# Altium schematic sheet TIDA-010954-FullBridge.SchDoc
size 431 x 279 mm; Date: Not shown in title block; ApprovedBy: Not shown in title block; CheckedBy: Not shown in title block; Author: Not shown in title block; CompanyName: Not shown in title block; Engineer: Not shown in title block; Organization: Not shown in title block; Address1: Not shown in title block; Address2: Not shown in title block; Address3: Not shown in title block; Address4: Not shown in title block; DocumentNumber: 2; Revision: Use project parameter SCH_Rev; SheetNumber: 4; SheetTotal: 9; PageSetup: Record=PageOptions|CenterHorizontal=True|CenterVertical=True|PrintScale=1.00|XCorrection=1.00|YCorrection=1.00|PrintKind=0|BorderSize=5000000|LeftOffset=0|BottomOffset=0|Orientation=2|PaperLength=1000|PaperWidth=1000|Scale=100|PaperSource=15|PrintQuality=600|MediaType=1|DitherType=10|PaperKind=Letter|PrintScaleMode=1; CurrentTime: Not shown in title block; CurrentDate: Not shown in title block; Time: Not shown in title block; DocumentFullPathAndName: Not shown in title block; DocumentName: Not shown in title block; ModifiedDate: 1/25/2022; ImagePath: Not shown in title block
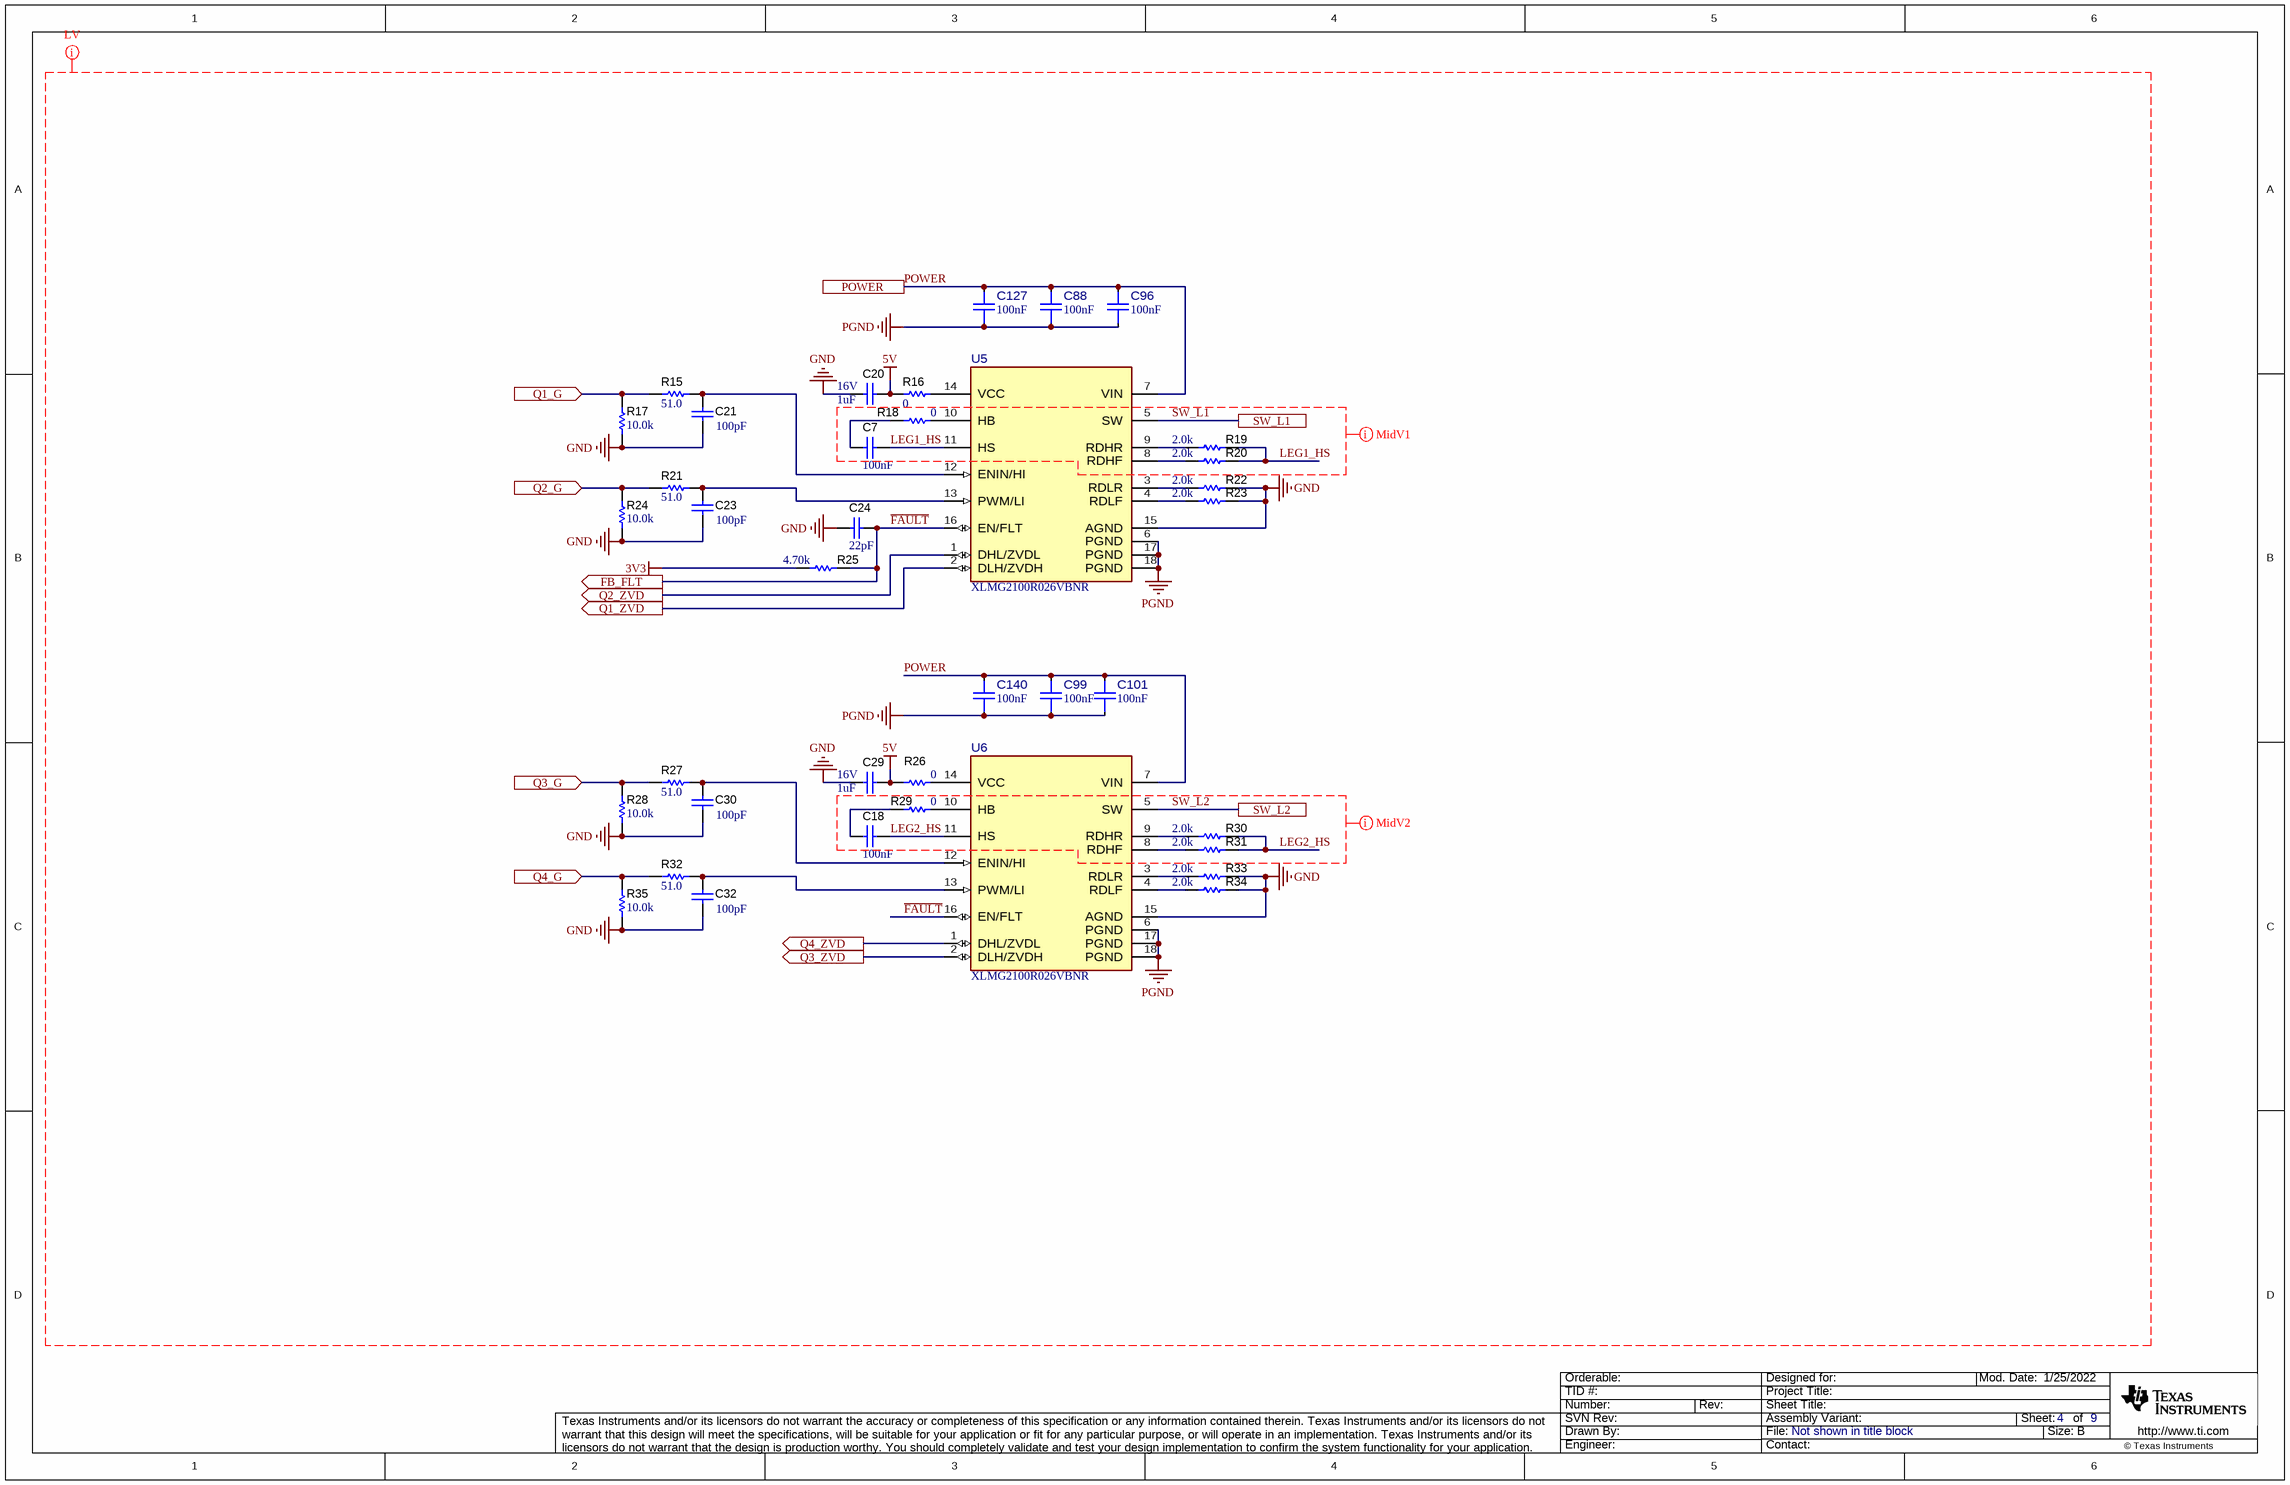
[diagram p0: TIDA-010954-FullBridge.SchDoc]

## Parts
C7  Cap_F: 100nF  [0603]  (hidden comment: CGA3E2X7R1E104K080AA)
C18  Cap_F: 100nF  [0603]  (hidden comment: CGA3E2X7R1E104K080AA)
C20  VDC_V: 16V  ValueDisplayed: 1uF  [0603]  (hidden comment: GRM185R61C105KE44D)
C21  ValueDisplayed: 100pF  [0603]  (hidden comment: GRM1885C1H101JA01D)
C23  ValueDisplayed: 100pF  [0603]  (hidden comment: GRM1885C1H101JA01D)
C24  ValueDisplayed: 22pF  [0603]  (hidden comment: GRM1885C1H220JA01D)
C29  VDC_V: 16V  ValueDisplayed: 1uF  [0603]  (hidden comment: GRM185R61C105KE44D)
C30  ValueDisplayed: 100pF  [0603]  (hidden comment: GRM1885C1H101JA01D)
C32  ValueDisplayed: 100pF  [0603]  (hidden comment: GRM1885C1H101JA01D)
C88  Cap_F: 100nF  [FP-GRM188R72A104KA35J_0603-MFG]  (hidden comment: GRM188R72A104KA35J)
C96  Cap_F: 100nF  [FP-GRM188R72A104KA35J_0603-MFG]  (hidden comment: GRM188R72A104KA35J)
C99  Cap_F: 100nF  [FP-GRM188R72A104KA35J_0603-MFG]  (hidden comment: GRM188R72A104KA35J)
C101  Cap_F: 100nF  [FP-GRM188R72A104KA35J_0603-MFG]  (hidden comment: GRM188R72A104KA35J)
C127  Cap_F: 100nF  [FP-GRM188R72A104KA35J_0603-MFG]  (hidden comment: GRM188R72A104KA35J)
C140  Cap_F: 100nF  [FP-GRM188R72A104KA35J_0603-MFG]  (hidden comment: GRM188R72A104KA35J)
R15  ValueDisplayed: 51.0  [0603]  (hidden comment: RC0603FR-0751RL)
R16  ValueDisplayed: 0  [0603]  (hidden comment: RC0603JR-070RL)
R17  ValueDisplayed: 10.0k  [0603]  (hidden comment: RC0603FR-0710KL)
R18  ValueDisplayed: 0  [0603]  (hidden comment: RC0603JR-070RL)
R19  ValueDisplayed: 2.0k  [0603]  (hidden comment: RC0603JR-072KL)
R20  ValueDisplayed: 2.0k  [0603]  (hidden comment: RC0603JR-072KL)
R21  ValueDisplayed: 51.0  [0603]  (hidden comment: RC0603FR-0751RL)
R22  ValueDisplayed: 2.0k  [0603]  (hidden comment: RC0603JR-072KL)
R23  ValueDisplayed: 2.0k  [0603]  (hidden comment: RC0603JR-072KL)
R24  ValueDisplayed: 10.0k  [0603]  (hidden comment: RC0603FR-0710KL)
R25  ValueDisplayed: 4.70k  [0603]  (hidden comment: RC0603FR-074K7L)
R26  ValueDisplayed: 0  [0603]  (hidden comment: RC0603JR-070RL)
R27  ValueDisplayed: 51.0  [0603]  (hidden comment: RC0603FR-0751RL)
R28  ValueDisplayed: 10.0k  [0603]  (hidden comment: RC0603FR-0710KL)
R29  ValueDisplayed: 0  [0603]  (hidden comment: RC0603JR-070RL)
R30  ValueDisplayed: 2.0k  [0603]  (hidden comment: RC0603JR-072KL)
R31  ValueDisplayed: 2.0k  [0603]  (hidden comment: RC0603JR-072KL)
R32  ValueDisplayed: 51.0  [0603]  (hidden comment: RC0603FR-0751RL)
R33  ValueDisplayed: 2.0k  [0603]  (hidden comment: RC0603JR-072KL)
R34  ValueDisplayed: 2.0k  [0603]  (hidden comment: RC0603JR-072KL)
R35  ValueDisplayed: 10.0k  [0603]  (hidden comment: RC0603FR-0710KL)
U5  XLMG2100R026VBNR  [VBN0018A-MFG]
U6  XLMG2100R026VBNR  [VBN0018A-MFG]

## Ports
FB_FLT (out), POWER, Q1_G (in), Q1_ZVD (out), Q2_G (in), Q2_ZVD (out), Q3_G (in), Q3_ZVD (out), Q4_G (in), Q4_ZVD (out), SW_L1, SW_L2

## Nets
3V3: R25.1
5V: C20.2 C29.2 R16.1 R26.1
GND: C20.1 C21.2 C23.2 C24.1 C29.1 C30.2 C32.2 R17.1 R22.2 R23.2 R24.1 R28.1 R33.2 R34.2 R35.1 U5.15(AGND) U6.15(AGND)
PGND: C88.1 C96.1 C99.1 C101.1 C127.1 C140.1 U5.6(PGND) U5.17(PGND) U5.18(PGND) U6.6(PGND) U6.17(PGND) U6.18(PGND)
~{FAULT}: C24.2 R25.2 U5.16(EN/FLT) U6.16(EN/FLT) ; port FB_FLT
LEG1_HS: C7.2 R19.2 R20.2 U5.11(HS)
LEG2_HS: C18.2 R30.2 R31.2 U6.11(HS)
POWER: C88.2 C96.2 C99.2 C101.2 C127.2 C140.2 U5.7(VIN) U6.7(VIN) ; port POWER
Q1_G: R15.1 R17.2 ; port Q1_G
Q1_ZVD: U5.2(DLH/ZVDH) ; port Q1_ZVD
Q2_G: R21.1 R24.2 ; port Q2_G
Q2_ZVD: U5.1(DHL/ZVDL) ; port Q2_ZVD
Q3_G: R27.1 R28.2 ; port Q3_G
Q3_ZVD: U6.2(DLH/ZVDH) ; port Q3_ZVD
Q4_G: R32.1 R35.2 ; port Q4_G
Q4_ZVD: U6.1(DHL/ZVDL) ; port Q4_ZVD
SW_L1: U5.5(SW) ; port SW_L1
SW_L2: U6.5(SW) ; port SW_L2
NetC7_1: C7.1 R18.1
NetC18_1: C18.1 R29.1
NetC21_1: C21.1 R15.2 U5.12(ENIN/HI)
NetC23_1: C23.1 R21.2 U5.13(PWM/LI)
NetC30_1: C30.1 R27.2 U6.12(ENIN/HI)
NetC32_1: C32.1 R32.2 U6.13(PWM/LI)
NetR16_2: R16.2 U5.14(VCC)
NetR18_2: R18.2 U5.10(HB)
NetR19_1: R19.1 U5.9(RDHR)
NetR20_1: R20.1 U5.8(RDHF)
NetR22_1: R22.1 U5.3(RDLR)
NetR23_1: R23.1 U5.4(RDLF)
NetR26_2: R26.2 U6.14(VCC)
NetR29_2: R29.2 U6.10(HB)
NetR30_1: R30.1 U6.9(RDHR)
NetR31_1: R31.1 U6.8(RDHF)
NetR33_1: R33.1 U6.3(RDLR)
NetR34_1: R34.1 U6.4(RDLF)

## Layout directives
net class MidV1: LEG1_HS, SW_L1
net class MidV2: LEG2_HS, SW_L2
net class LV: 3V3, 5V, GND, LEG1_HS, LEG2_HS, PGND, POWER, SW_L1, SW_L2, ~{FAULT}

## Notes on the sheet
- Drawn By:
- SVN Rev:
- Number:
- TID #:
- Orderable:
- Rev:
- Sheet Title:
- File:
- Project Title:
- Designed for:
- Assembly Variant:
- Mod. Date:
- Sheet:
- Size:
- of
- B
- http://www.ti.com
- Texas Instruments and/or its licensors do not warrant the accuracy or completeness of this specification or any information contained therein. Texas Instruments and/or its licensors do not warrant that this design will meet the specifications, will be suitable for your application or fit for any particular purpose, or will operate in an implementation. Texas Instruments and/or its licensors do not warrant that the design is production worthy. You should completely validate and test your design implementation to confirm the system functionality for your application.
- Engineer:
- Contact:
- © Texas Instruments

## Library data of the parts
C7 C18 = CMP-0007077-5: CAP, CERM, 0.1 uF, 25 V, +/- 10%, X7R, AEC-Q200 Grade 1, 0603; Manufacturer: TDK; TaMin_C: -55°C; Polarized: N; SizeAreaWB_mm2: 4.68; Value1: Unknown; U/M: EA; Value: 0.1uF; TaMax_C: 125°C; SizeZ_mm: 1; SizeX_mm: 1.6; SizeY_mm: 0.8; Value2: 25V; SizeArea_mm2: 1.28; AEC Qualified: Y; AEC Category: Q200; Supplier Part Number 2: 79Y4100; Publisher: Texas Instruments; Supplier 2: Newark; Supplier Part Number 3: 810-CGA3E2X7R1E104K; TempCo: X7R; Supplier 3: Mouser; Published: 2008-06-19; RoHS: Y; MountType: SMT; Supplier 1: Digi-Key; PackageReference: 0603; Tolerance_%: 10%; Cap_Case: 0603; CompType: Capacitor; LatestRevisionDate: 2017-03-09; PartNumber: CGA3E2X7R1E104K080AA; VDC_V: 25V; ComponentLink1Description: Datasheet link; AEC Grade: 1; Supplier Part Number 1: 445-5667-1-ND; Technology: Ceramic; ValueDisplayed: 0.1uF; ComponentLink1URL: https://product.tdk.com/info/en/documents/chara_sheet/CGA3E2X7R1E104K080AA.pdf
C20 C29 = CMP-0007157-5: CAP, CERM, 1 uF, 16 V, +/- 10%, X5R, 0603; Manufacturer: MuRata; TaMin_C: -55°C; Polarized: N; SizeAreaWB_mm2: 4.68; Value1: Unknown; U/M: EA; Value: 1uF; TaMax_C: 85°C; SizeZ_mm: 1; SizeX_mm: 1.6; SizeY_mm: 0.8; SizeArea_mm2: 1.28; Cap_F: 1µF; AEC Category: Q200; Supplier Part Number 2: 81-GRM185R61C105KE44; Publisher: Texas Instruments; Supplier 2: Mouser; Supplier Part Number 3: 1845733; TempCo: X5R; Supplier 3: Farnell; Published: 2008-06-19; RoHS: Y; MountType: SMT; Supplier 1: Digi-Key; PackageReference: 0603; Tolerance_%: 10%; Cap_Case: 0603; Value2: 16V; CompType: Capacitor; LatestRevisionDate: 2017-03-09; PartNumber: GRM185R61C105KE44D; AEC Qualified: ?; ComponentLink1Description: Datasheet link; Supplier Part Number 1: 490-3894-1-ND; Technology: Ceramic; ComponentLink1URL: http://search.murata.co.jp/Ceramy/PnsearchViewAction.do?HnOFG=ON&HnNFG=ON&SEL_CNT=50&sLang=en&sKey=GRM185R61C105KE44D&x=9&y=9&search=startwith
C21 C23 C30 C32 = CMP-0007171-4: CAP, CERM, 100 pF, 50 V, +/- 5%, C0G/NP0, 0603; Manufacturer: MuRata; TaMin_C: -55°C; Polarized: N; SizeAreaWB_mm2: 4.68; Value1: Unknown; U/M: EA; Value: 100pF; TaMax_C: 125°C; SizeZ_mm: 1; SizeX_mm: 1.6; SizeY_mm: 0.8; Value2: 50V; SizeArea_mm2: 1.28; AEC Category: Q200; Supplier Part Number 2: 81-GRM39C101J50; Publisher: Texas Instruments; Supplier 2: Mouser; Supplier Part Number 3: 8819866; TempCo: C0G/NP0; Supplier 3: Farnell; Published: 2008-06-19; RoHS: Y; MountType: SMT; Supplier 1: Digi-Key; PackageReference: 0603; Tolerance_%: 5%; Cap_Case: 0603; CompType: Capacitor; LatestRevisionDate: 2017-03-09; PartNumber: GRM1885C1H101JA01D; AEC Qualified: ?; Cap_F: 100pF; VDC_V: 50V; ComponentLink1Description: Datasheet link; Supplier Part Number 1: 490-1427-1-ND; Technology: Ceramic; ComponentLink1URL: http://search.murata.co.jp/Ceramy/PnsearchViewAction.do?HnOFG=ON&HnNFG=ON&SEL_CNT=50&sLang=en&sKey=GRM1885C1H101JA01D&x=9&y=9&search=startwith
C24 = CMP-0007196-4: CAP, CERM, 22 pF, 50 V, +/- 5%, C0G/NP0, 0603; Manufacturer: MuRata; TaMin_C: -55°C; Polarized: N; SizeAreaWB_mm2: 4.68; Value1: Unknown; U/M: EA; Value: 22pF; TaMax_C: 125°C; SizeZ_mm: 1; SizeX_mm: 1.6; SizeY_mm: 0.8; Value2: 50V; SizeArea_mm2: 1.28; AEC Category: Q200; Supplier Part Number 2: 81-GRM39C220J50; Publisher: Texas Instruments; Supplier 2: Mouser; Supplier Part Number 3: 8819831; TempCo: C0G/NP0; Supplier 3: Farnell; Published: 2008-06-19; RoHS: Y; MountType: SMT; Supplier 1: Digi-Key; PackageReference: 0603; Tolerance_%: 5%; Cap_Case: 0603; CompType: Capacitor; LatestRevisionDate: 2017-03-09; PartNumber: GRM1885C1H220JA01D; AEC Qualified: ?; Cap_F: 22pF; VDC_V: 50V; ComponentLink1Description: Datasheet link; Supplier Part Number 1: 490-1411-1-ND; Technology: Ceramic; ComponentLink1URL: http://search.murata.co.jp/Ceramy/PnsearchViewAction.do?HnOFG=ON&HnNFG=ON&SEL_CNT=50&sLang=en&sKey=GRM1885C1H220JA01D&x=9&y=9&search=startwith
C88 C96 C99 C101 C127 C140 = CMP-0122713-1: Chip Multilayer Ceramic Capacitors for General Purpose, 0603, 0.10uF, X7R, 15%, 10%, 100V; Manufacturer: Murata; AEC Qualified: No; SizeZ_mm: 0.9mm; Value: 100nF; PackageReference: 0603; PartNumber: GRM188R72A104KA35J; RoHS: TRUE; TempCo: 15%; Tolerance_%: 10%; ValueDisplayed: 0.10uF; VDC_V: 100V; Part Number: GRM188R72A104KA35J; datasheet: https://www.murata.com/en-us/products/productdetail?partno=GRM188R72A104KA35%23; Datasheet Path: datasheets/Cap-GRM188R72A104KA35J.pdf; helpURL: https://upverter.com/upn/revision/71520f38ae33ed89/; Lead Free: Yes; Operating Temperature Range: -55°C to +125°C; Temperature Characteristic: X7R; ComponentLink1Description: Datasheet; ComponentLink1URL: https://www.murata.com/en-us/products/productdetail?partno=GRM188R72A104KA35%23
R15 R21 R27 R32 = CMP-0023169-5: RES, 51.0, 1%, 0.1 W, 0603; Manufacturer: Yageo; Power_W: 100mW; TempCo: 100 ppm/C; Value_Code: 51R0; Value: 51.0; Res_ohm: 51; SizeX_mm: 1.6; SizeY_mm: 0.8; SizeZ_mm: 1; Value2: 0.1W; SizeArea_mm2: 1.28; AEC Qualified: N; VDC_V: 75V; AEC Category: Q200; SizeAreaWB_mm2: 4.68; Supplier Part Number 2: 603-RC0603FR-0751RL; Supplier 2: Mouser; Supplier Part Number 3: 1799350; Supplier 3: Farnell; RoHS: Y; Value1: 1%; Supplier 1: Digi-Key; PackageReference: 0603; Tolerance_%: 1%; CompType: Resistor; PartNumber: RC0603FR-0751RL; ComponentLink1Description: Datasheet link; Supplier Part Number 1: 311-51.0HRCT-ND; Technology: Thick Film; MountType: SMT; ComponentLink1URL: http://www.yageo.com/pdf/Pu-RC0603_51_PbFree_L_2.pdf; AEC Grade: N/A
R16 R18 R26 R29 = CMP-0025885-5: RES, 0, 5%, 0.1 W, 0603; Manufacturer: Yageo; Power_W: 100mW; TempCo: 200 ppm/C; Value_Code: 0000; Value: 0; EIA_Code: E24; SizeX_mm: 1.6; SizeZ_mm: 1; Value2: 0.1W; SizeArea_mm2: 1.28; AEC Qualified: N; VDC_V: 75V; AEC Category: Q200; SizeY_mm: 0.8; SizeAreaWB_mm2: 4.68; Supplier Part Number 2: 603-RC0603JR-070RL; Supplier 2: Mouser; Supplier Part Number 3: 9233130; Supplier 3: Farnell; RoHS: Y; Value1: 5%; MountType: SMT; Supplier 1: Digi-Key; PackageReference: 0603; Tolerance_%: 5%; Res_ohm: 0; CompType: Resistor; PartNumber: RC0603JR-070RL; ComponentLink1Description: Datasheet link; Supplier Part Number 1: 311-0.0GRCT-ND; Technology: Thick Film; ComponentLink1URL: http://www.yageo.com/pdf/Pu-RC0603_51_PbFree_L_2.pdf; AEC Grade: N/A
R17 R24 R28 R35 = CMP-0022746-5: RES, 10.0 k, 1%, 0.1 W, 0603; Manufacturer: Yageo; Power_W: 100mW; TempCo: 100 ppm/C; Value_Code: 10k0; Value: 10.0k; EIA_Code: E96; Res_ohm: 10k; SizeX_mm: 1.6; SizeY_mm: 0.8; SizeZ_mm: 1; Value2: 0.1W; SizeArea_mm2: 1.28; AEC Qualified: N; VDC_V: 75V; AEC Category: Q200; SizeAreaWB_mm2: 4.68; Supplier Part Number 2: 603-RC0603FR-0710KL; Supplier 2: Mouser; Supplier Part Number 3: 9238603; Supplier 3: Farnell; RoHS: Y; Value1: 1%; MountType: SMT; Supplier 1: Digi-Key; PackageReference: 0603; Tolerance_%: 1%; CompType: Resistor; PartNumber: RC0603FR-0710KL; ComponentLink1Description: Datasheet link; Supplier Part Number 1: 311-10.0KHRCT-ND; Technology: Thick Film; ComponentLink1URL: http://www.yageo.com/pdf/Pu-RC0603_51_PbFree_L_2.pdf; AEC Grade: N/A
R19 R20 R22 R23 R30 R31 R33 R34 = CMP-0025909-5: RES, 2.0 k, 5%, 0.1 W, 0603; Manufacturer: Yageo; Power_W: 100mW; TempCo: 100 ppm/C; Value_Code: 2k00; Value: 2.0k; EIA_Code: E24; Res_ohm: 2k; SizeX_mm: 1.6; SizeY_mm: 0.8; SizeZ_mm: 1; Value2: 0.1W; SizeArea_mm2: 1.28; AEC Qualified: N; VDC_V: 75V; AEC Category: Q200; SizeAreaWB_mm2: 4.68; Supplier Part Number 2: 603-RC0603JR-072KL; Supplier 2: Mouser; Supplier Part Number 3: 1799398; Supplier 3: Farnell; RoHS: Y; Value1: 5%; MountType: SMT; Supplier 1: Digi-Key; PackageReference: 0603; Tolerance_%: 5%; CompType: Resistor; PartNumber: RC0603JR-072KL; ComponentLink1Description: Datasheet link; Supplier Part Number 1: 311-2.0KGRCT-ND; Technology: Thick Film; ComponentLink1URL: http://www.yageo.com/pdf/Pu-RC0603_51_PbFree_L_2.pdf; AEC Grade: N/A
R25 = CMP-0023153-5: RES, 4.70 k, 1%, 0.1 W, 0603; Manufacturer: Yageo; Power_W: 100mW; TempCo: 100 ppm/C; Value_Code: 4k70; Value: 4.70k; Res_ohm: 4.7k; SizeX_mm: 1.6; SizeY_mm: 0.8; SizeZ_mm: 1; Value2: 0.1W; SizeArea_mm2: 1.28; AEC Qualified: N; VDC_V: 75V; AEC Category: Q200; SizeAreaWB_mm2: 4.68; Supplier Part Number 2: 603-RC0603FR-074K7L; Supplier 2: Mouser; Supplier Part Number 3: 9238565; Supplier 3: Farnell; RoHS: Y; Value1: 1%; MountType: SMT; Supplier 1: Digi-Key; PackageReference: 0603; Tolerance_%: 1%; CompType: Resistor; PartNumber: RC0603FR-074K7L; ComponentLink1Description: Datasheet link; Supplier Part Number 1: 311-4.70KHRCT-ND; Technology: Thick Film; ComponentLink1URL: http://www.yageo.com/pdf/Pu-RC0603_51_PbFree_L_2.pdf; AEC Grade: N/A
U5 U6 = CMP-0122483-1: 170-V GaN Half-Bridge Power Stages; Manufacturer: Texas Instruments; Part Number: LMG2175; SizeZ_mm: 0.85mm; AEC Qualified: No; Max Supply Voltage: 5.5V; Min Supply Voltage: 4.5V; Nominal Supply Current: 8.5mA; Number Of Outputs: 1; Standoff Height: 0mm; TJmax_C: +150°C; PackageReference: VQFN-FCRLF18; PartNumber: XLMG2100R026VBNR; RoHS: UNKNOWN; Operating Temperature Range: -40°C to +150°C; Datasheet Path: datasheets/IC-LMG2175.pdf; helpURL: https://upverter.com/upn/revision/effccdb2183bc5a0/